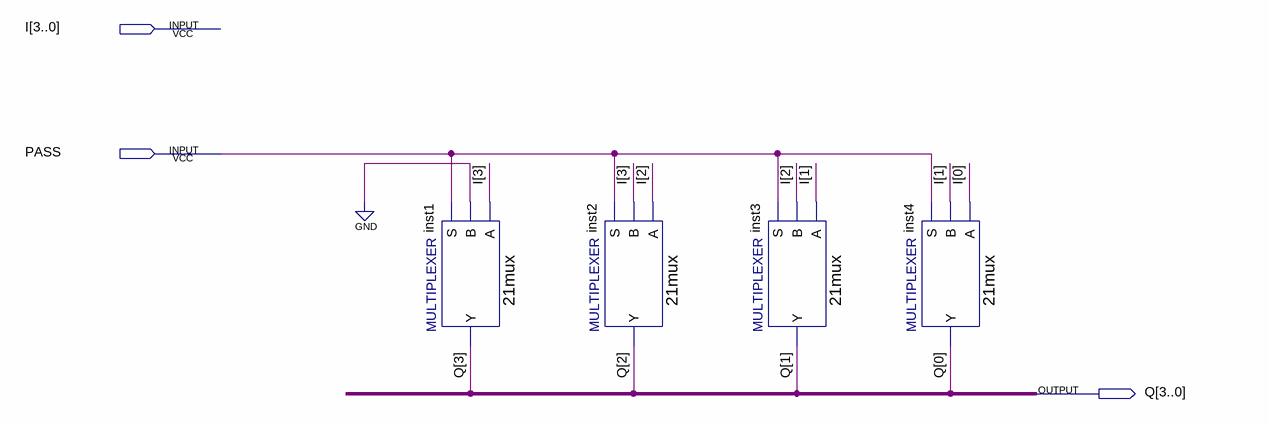
[diagram p0: schematic sheet]
// Quartus schematic shifter.bdf as structural Verilog: 4 symbols, 3 pins
module shifter (
  input  [3:0] I,
  input  PASS,
  output [3:0] Q
);

  \21mux  inst1 (.S(PASS), .B(1'b0), .A(I[3]), .Y(Q[3]));
  \21mux  inst2 (.S(PASS), .B(I[3]), .A(I[2]), .Y(Q[2]));
  \21mux  inst3 (.S(PASS), .B(I[2]), .A(I[1]), .Y(Q[1]));
  \21mux  inst4 (.S(PASS), .B(I[1]), .A(I[0]), .Y(Q[0]));
endmodule
